# EAGLE schematic buscard (EAGLE 7.6.0)
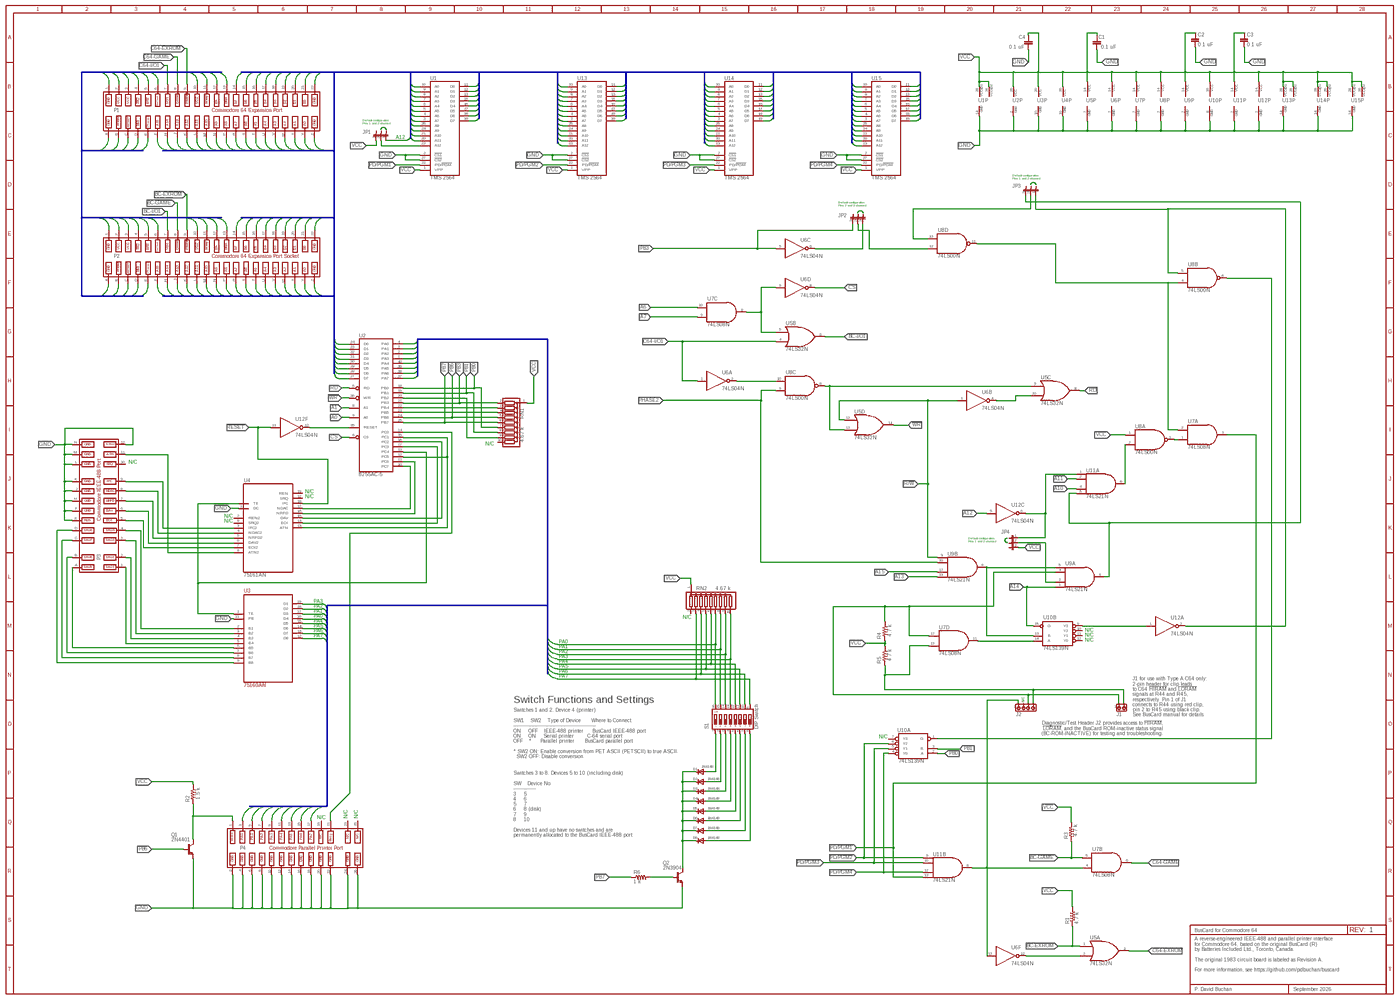
[diagram p0: schematic, sheet 1, overview]
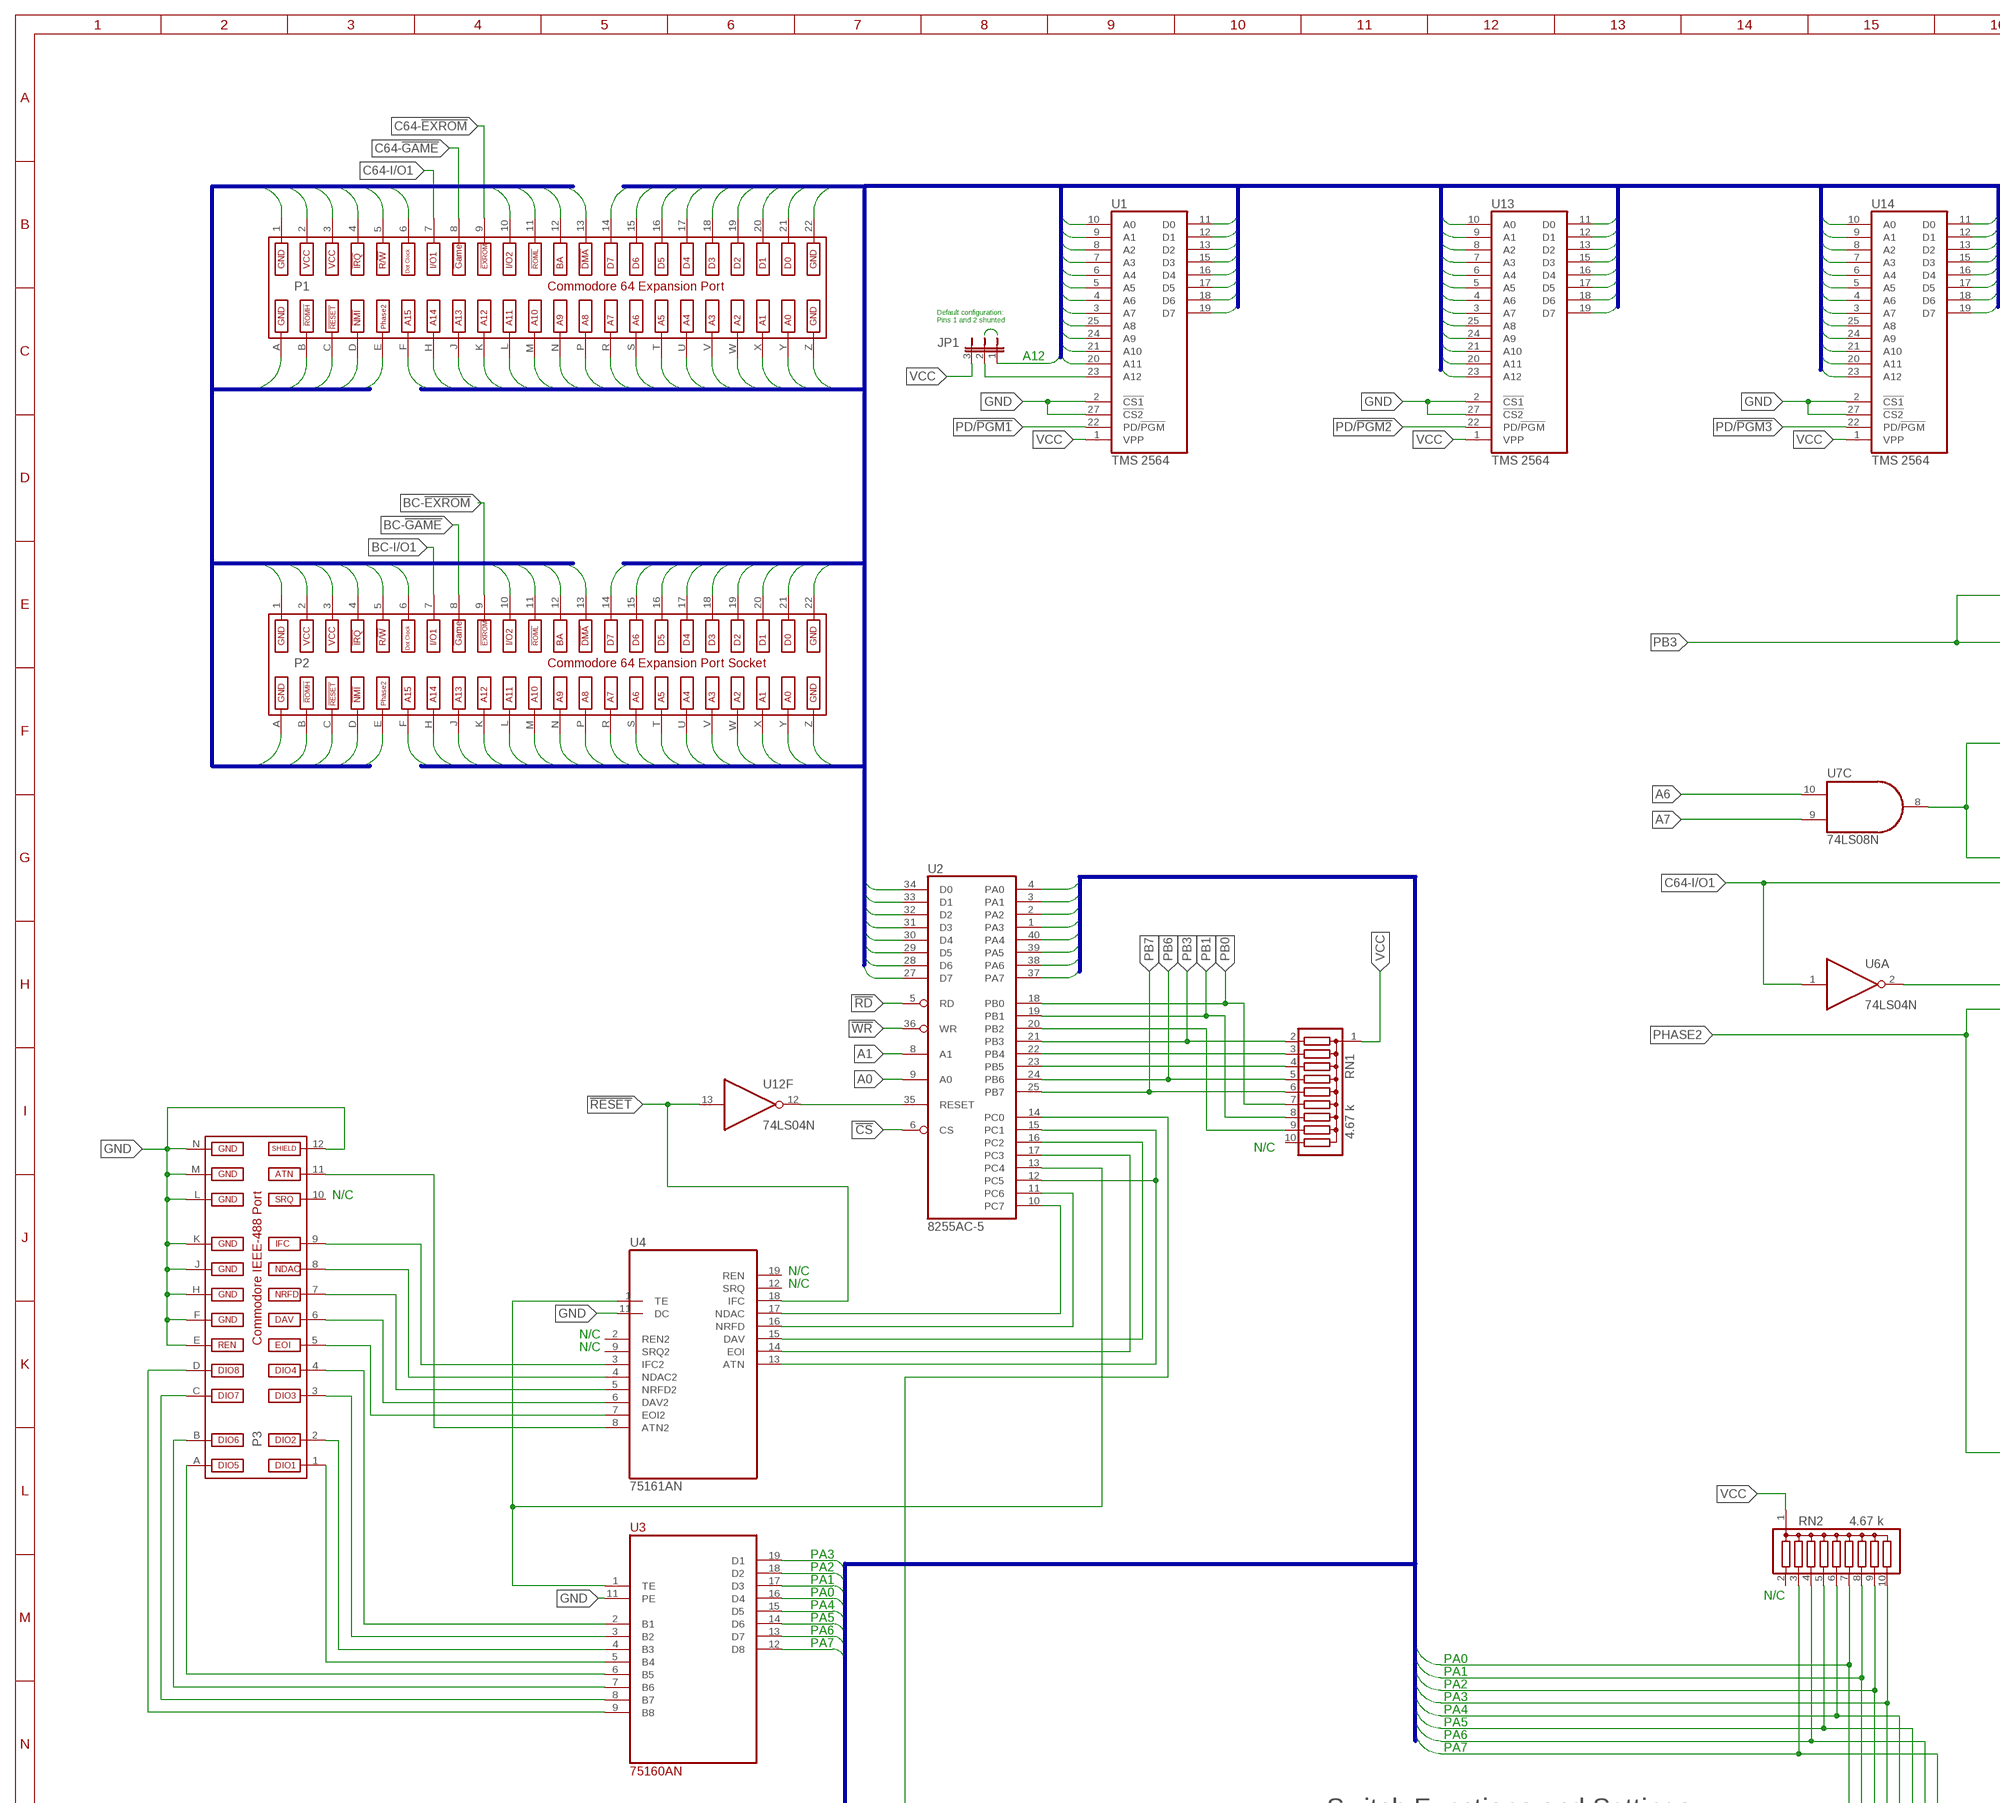
[diagram p1: schematic, sheet 1, part 1 of 4]
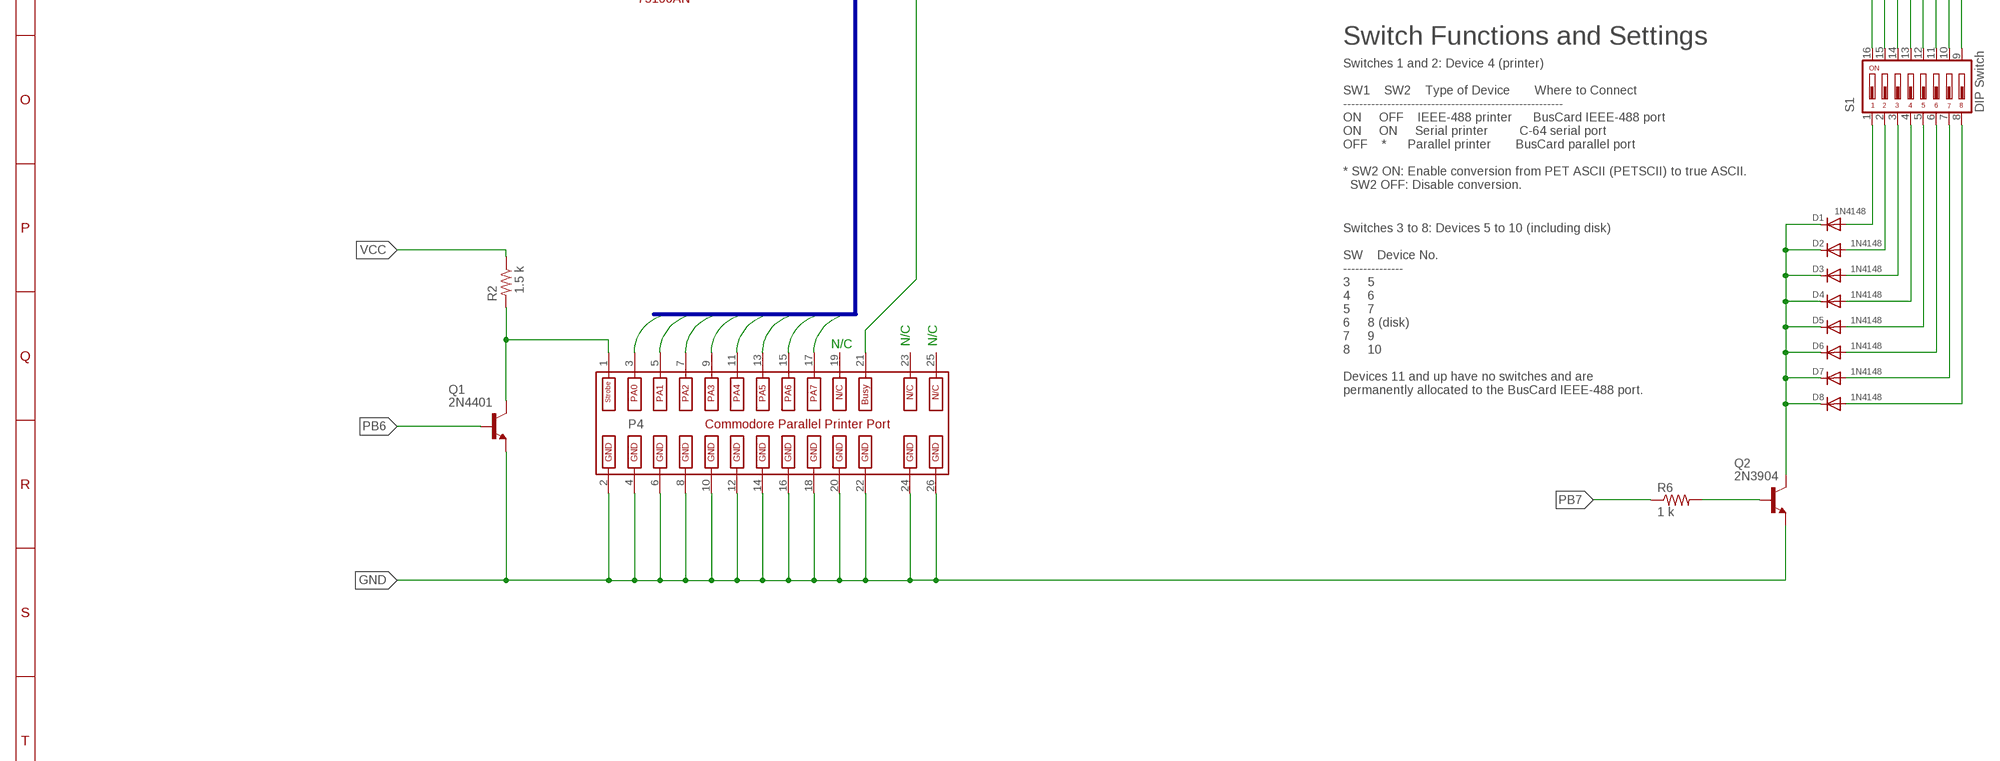
[diagram p2: schematic, sheet 1, part 2 of 4]
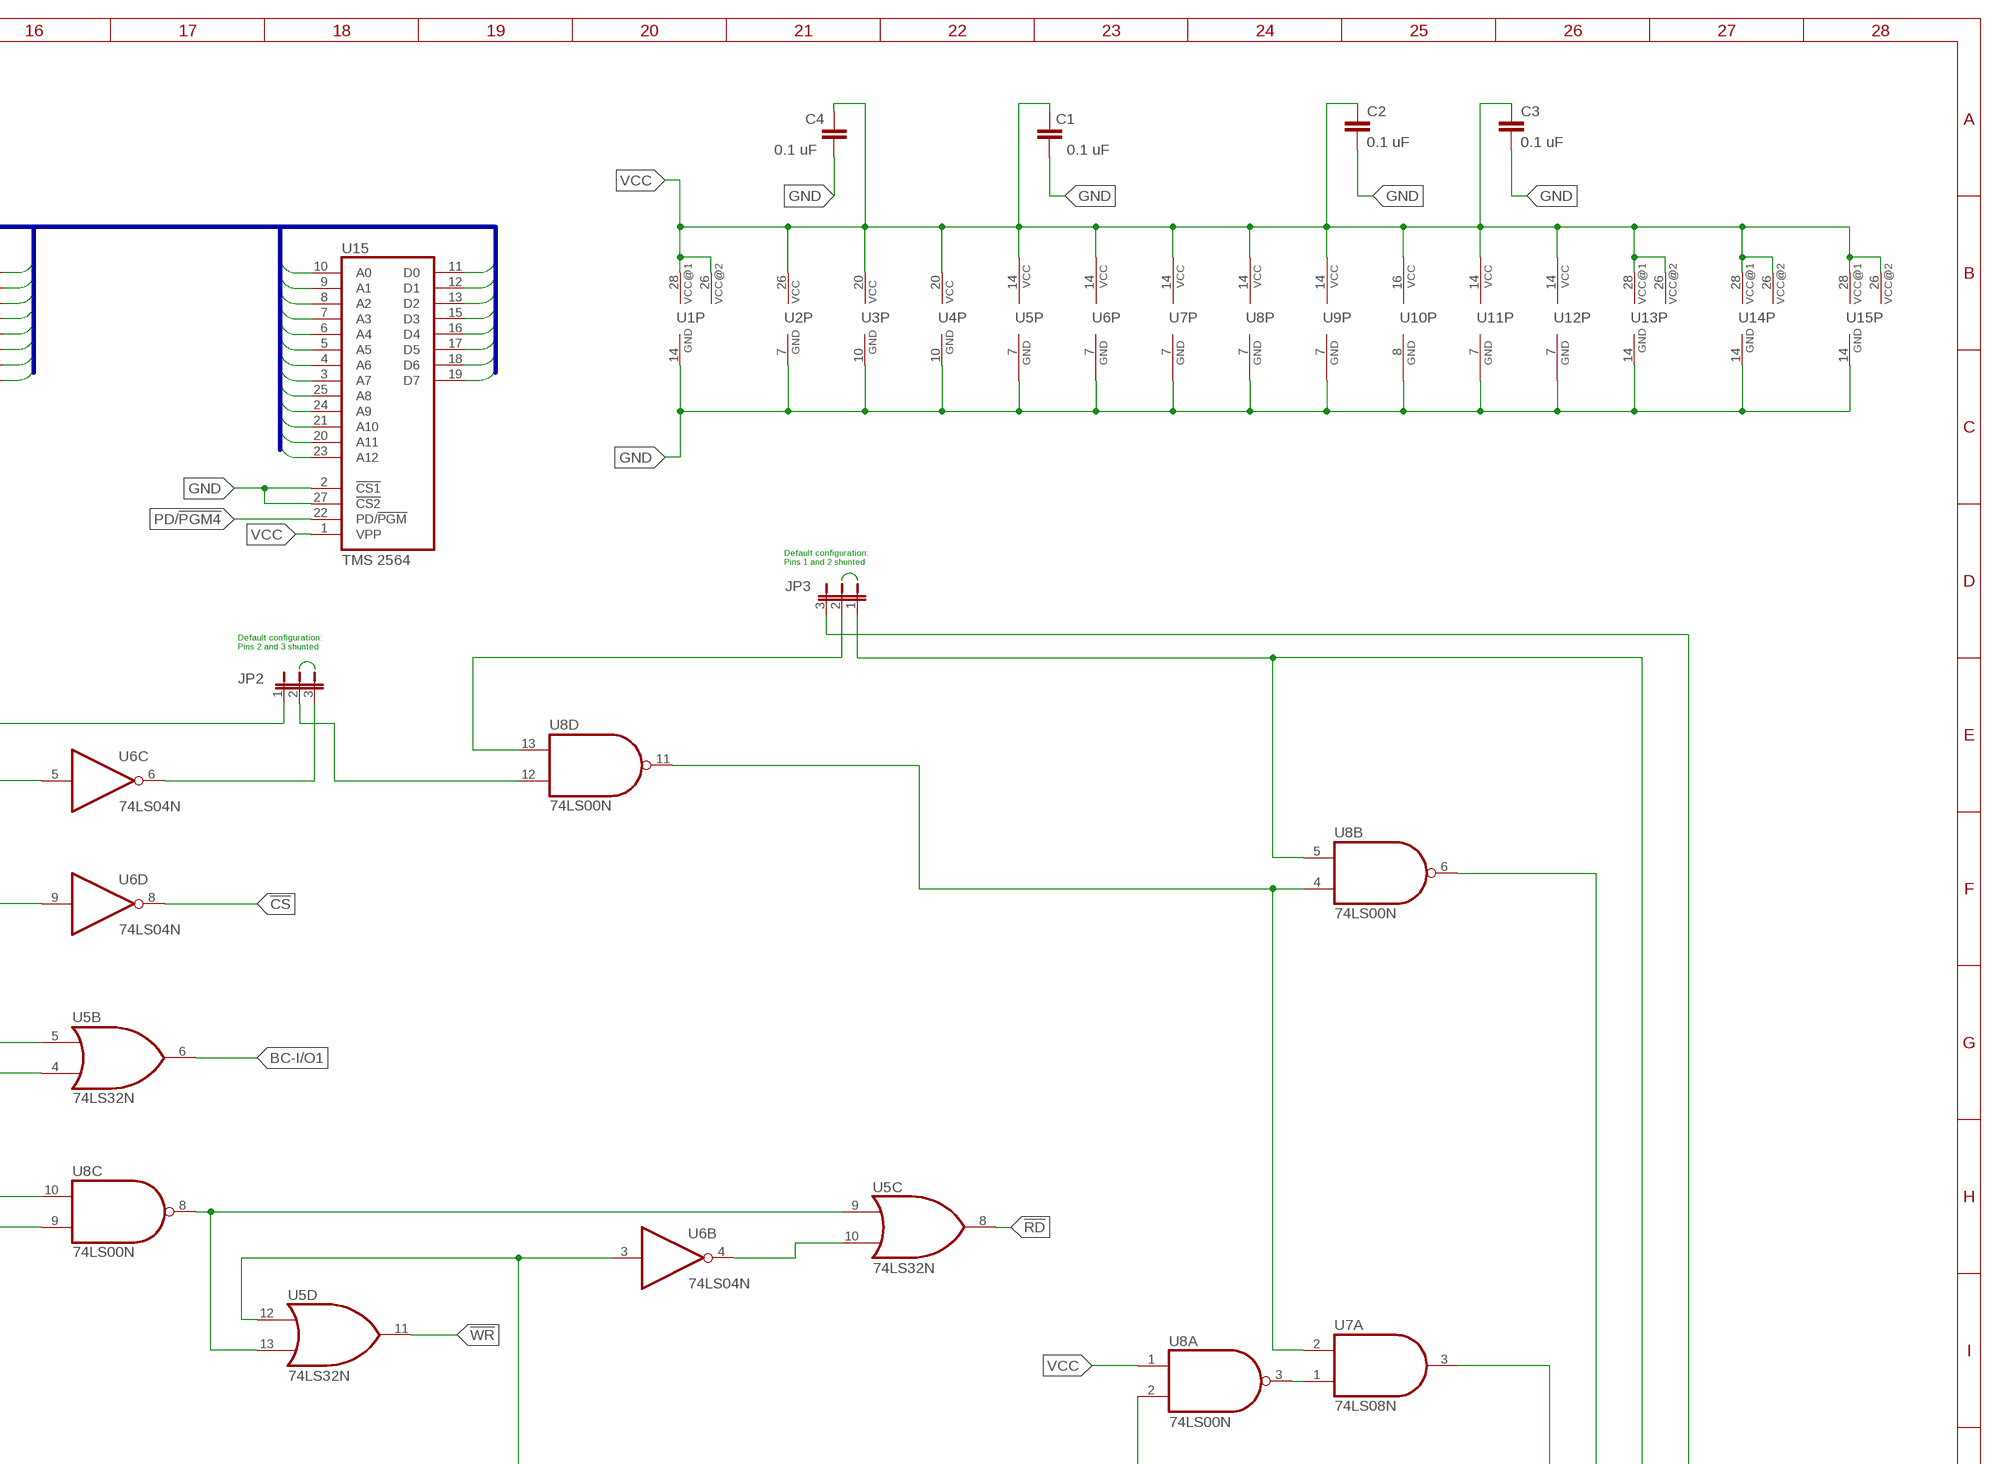
[diagram p3: schematic, sheet 1, part 3 of 4]
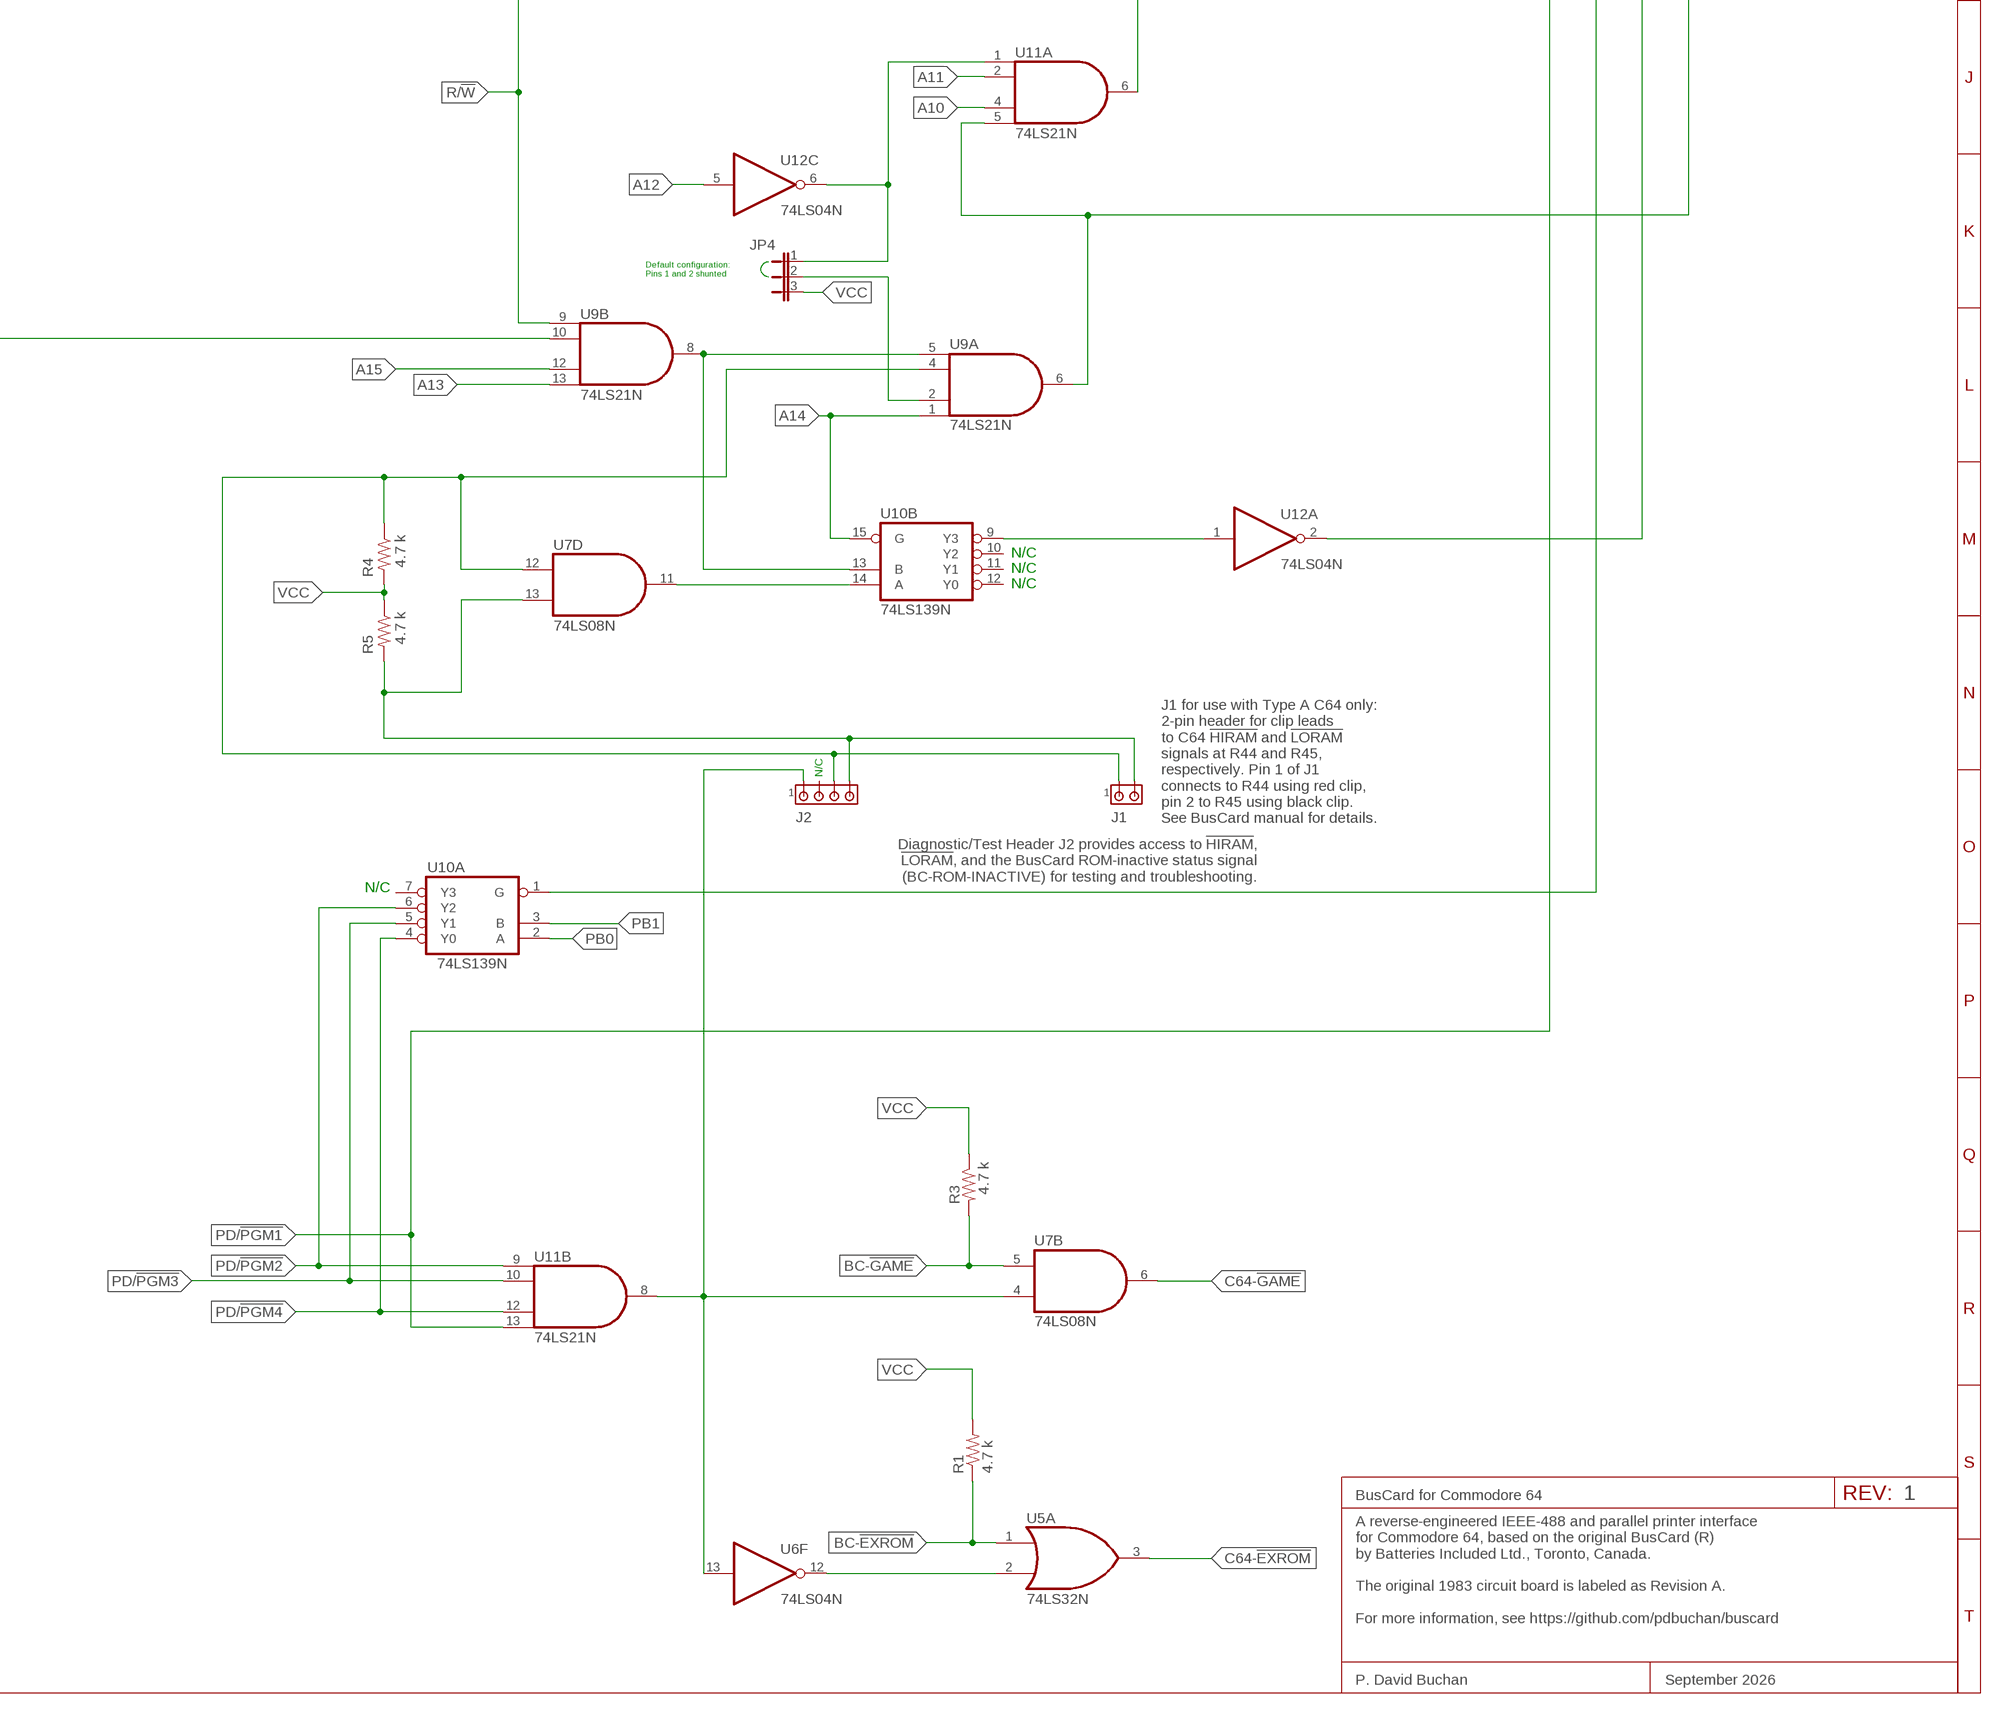
[diagram p4: schematic, sheet 1, part 4 of 4]

## Parts
C1  0.1 uF  C-EU075-032X103  [C075-032X103]
C2  0.1 uF  C-EU075-032X103  [C075-032X103]
C3  0.1 uF  C-EU075-032X103  [C075-032X103]
C4  0.1 uF  C-EU075-032X103  [C075-032X103]
D1  1N4148  DIODE-1N4148DO-1N4148  [DO-1N4148-0.2]
D2  1N4148  DIODE-1N4148DO-1N4148  [DO-1N4148-0.2]
D3  1N4148  DIODE-1N4148DO-1N4148  [DO-1N4148-0.2]
D4  1N4148  DIODE-1N4148DO-1N4148  [DO-1N4148-0.2]
D5  1N4148  DIODE-1N4148DO-1N4148  [DO-1N4148-0.2]
D6  1N4148  DIODE-1N4148DO-1N4148  [DO-1N4148-0.2]
D7  1N4148  DIODE-1N4148DO-1N4148  [DO-1N4148-0.2]
D8  1N4148  DIODE-1N4148DO-1N4148  [DO-1N4148-0.2]
J1  MTA02-100  [10X02MTA]
J2  MTA04-100  [10X04MTA]
JP1  JUMPER-HEADER-3-POSMTA-100  [JUMPER-HEADER-3-POS]
JP2  JUMPER-HEADER-3-POSMTA-100  [JUMPER-HEADER-3-POS]
JP3  JUMPER-HEADER-3-POSMTA-100  [JUMPER-HEADER-3-POS]
JP4  JUMPER-HEADER-3-POSMTA-100  [JUMPER-HEADER-3-POS]
P1  COMMODORE_64_EXPANSION_PORT_CARD_EDGE  [COMMODORE_64_EXPANSION_PORT_CARD_EDGE]
P2  FEMALE_44-PIN_CARD_EDGE_CONNECTOR  [FEMALE_44-PIN_CARD_EDGE_CONNECTOR]
P3  COMMODORE_IEEE-488_PORT_CARD_EDGE  [COMMODORE_IEEE-488_PORT_CARD_EDGE]
P4  Parallel Port  COMMODORE_PARALLEL_PORT_CARD_EDGE  [COMMODORE_PARALLEL_PORT_CARD_EDGE]
Q1  2N4401  2N4401-NPN-TO92-EBC  [TO92-EBC]
Q2  2N3904  [TO92]
R1  4.7 k  R-US_0207/10  [0207/10]
R2  1.5 k  R-US_0207/10  [0207/10]
R3  4.7 k  R-US_0207/10  [0207/10]
R4  4.7 k  R-US_0207/10  [0207/10]
R5  4.7 k  R-US_0207/10  [0207/10]
R6  1 k  R-US_0207/10  [0207/10]
RN1  4.67 k  G09R  [SIL10]
RN2  4.67 k  G09R  [SIL10]
S1  DIP Switch  DS08  [DS-08]
U1  TMS 2564  2564  [DIL28]
U2  8255AC-5  8255A  [DIL40]
U3  75160AN  [DIL20]
U4  75161AN  [DIL20]
U5  74LS32N  [DIL14]
U6  74LS04N  [DIL14]
U7  74LS08N  [DIL14]
U8  74LS00N  [DIL14]
U9  74LS21N  [DIL14]
U10  74LS139N  [DIL16]
U11  74LS21N  [DIL14]
U12  74LS04N  [DIL14]
U13  TMS 2564  2564  [DIL28]
U14  TMS 2564  2564  [DIL28]
U15  TMS 2564  2564  [DIL28]

## Nets
!CS: U2.6(CS) U6.8(D:O)
!DMA: P1.13(!DMA) P2.13(!DMA)
!IRQ: P1.4(!IRQ) P2.4(!IRQ)
!NMI: P1.D(!NMI) P2.D(!NMI)
!RD: U2.5(RD) U5.8(C:O)
!RESET: P1.C(!RESET) P2.C(!RESET) U4.18(IFC) U12.13(F:I)
!ROMH: P1.B(!ROMH) P2.B(!ROMH)
!ROML: P1.11(!ROML) P2.11(!ROML)
!WR: U2.36(WR) U5.11(D:O)
A0: P1.Y(A0) P2.Y(A0) U1.10(A0) U2.9(A0) U13.10(A0) U14.10(A0) U15.10(A0)
A1: P1.X(A1) P2.X(A1) U1.9(A1) U2.8(A1) U13.9(A1) U14.9(A1) U15.9(A1)
A2: P1.W(A2) P2.W(A2) U1.8(A2) U13.8(A2) U14.8(A2) U15.8(A2)
A3: P1.V(A3) P2.V(A3) U1.7(A3) U13.7(A3) U14.7(A3) U15.7(A3)
A4: P1.U(A4) P2.U(A4) U1.6(A4) U13.6(A4) U14.6(A4) U15.6(A4)
A5: P1.T(A5) P2.T(A5) U1.5(A5) U13.5(A5) U14.5(A5) U15.5(A5)
A6: P1.S(A6) P2.S(A6) U1.4(A6) U7.10(C:I1) U13.4(A6) U14.4(A6) U15.4(A6)
A7: P1.R(A7) P2.R(A7) U1.3(A7) U7.9(C:I0) U13.3(A7) U14.3(A7) U15.3(A7)
A8: P1.P(A8) P2.P(A8) U1.25(A8) U13.25(A8) U14.25(A8) U15.25(A8)
A9: P1.N(A9) P2.N(A9) U1.24(A9) U13.24(A9) U14.24(A9) U15.24(A9)
A10: P1.M(A10) P2.M(A10) U1.21(A10) U11.4(A:I2) U13.21(A10) U14.21(A10) U15.21(A10)
A11: P1.L(A11) P2.L(A11) U1.20(A11) U11.2(A:I1) U13.20(A11) U14.20(A11) U15.20(A11)
A12: JP1.1 P1.K(A12) P2.K(A12) U12.5(C:I) U13.23(A12) U14.23(A12) U15.23(A12)
A13: P1.J(A13) P2.J(A13) U9.13(B:I3)
A14: P1.H(A14) P2.H(A14) U9.1(A:I0) U10.15(B:G)
A15: P1.F(A15) P2.F(A15) U9.12(B:I2)
ATN: P3.11(ATN) U4.8(ATN2)
BA: P1.12(BA) P2.12(BA)
BC-!EXROM: P2.9(!EXROM) R1.1 U5.1(A:I0)
BC-!GAME: P2.8(!GAME) R3.2 U7.5(B:I1)
BC-I/O1: P2.7(I/O1) U5.6(B:O)
BC-ROM-INACTIVE: J2.1 U6.13(F:I) U7.4(B:I0) U11.8(B:O)
BUSY: P4.21(BUSY) U2.14(PC0)
C64-!EXROM: P1.9(!EXROM) U5.3(A:O)
C64-!GAME: P1.8(!GAME) U7.6(B:O)
C64-I/O1: P1.7(I/O1) U5.4(B:I0) U6.1(A:I)
CLIP1: J1.2 J2.4 R5.2 U7.13(D:I1)
CLIP2: J1.1 J2.3 R4.1 U7.12(D:I0) U9.4(A:I2)
D0: P1.21(D0) P2.21(D0) U1.11(D0) U2.34(D0) U13.11(D0) U14.11(D0) U15.11(D0)
D1: P1.20(D1) P2.20(D1) U1.12(D1) U2.33(D1) U13.12(D1) U14.12(D1) U15.12(D1)
D2: P1.19(D2) P2.19(D2) U1.13(D2) U2.32(D2) U13.13(D2) U14.13(D2) U15.13(D2)
D3: P1.18(D3) P2.18(D3) U1.15(D3) U2.31(D3) U13.15(D3) U14.15(D3) U15.15(D3)
D4: P1.17(D4) P2.17(D4) U1.16(D4) U2.30(D4) U13.16(D4) U14.16(D4) U15.16(D4)
D5: P1.16(D5) P2.16(D5) U1.17(D5) U2.29(D5) U13.17(D5) U14.17(D5) U15.17(D5)
D6: P1.15(D6) P2.15(D6) U1.18(D6) U2.28(D6) U13.18(D6) U14.18(D6) U15.18(D6)
D7: P1.14(D7) P2.14(D7) U1.19(D7) U2.27(D7) U13.19(D7) U14.19(D7) U15.19(D7)
DAV: P3.6(DAV) U4.6(DAV2)
DIO1: P3.1(DIO1) U3.5(B4)
DIO2: P3.2(DIO2) U3.4(B3)
DIO3: P3.3(DIO3) U3.3(B2)
DIO4: P3.4(DIO4) U3.2(B1)
DIO5: P3.A(DIO5) U3.6(B5)
DIO6: P3.B(DIO6) U3.7(B6)
DIO7: P3.C(DIO7) U3.8(B7)
DIO8: P3.D(DIO8) U3.9(B8)
DOT_CLOCK: P1.6(DOT_CLOCK) P2.6(DOT_CLOCK)
EOI: P3.5(EOI) U4.7(EOI2)
GND: C1.1 C2.2 C3.2 C4.2 P1.1(GND) P1.22(GND) P1.A(GND) P1.Z(GND) P2.1(GND) P2.22(GND) P2.A(GND) P2.Z(GND) P3.12(SHIELD) P3.E(REN) P3.F(GND) P3.H(GND) P3.J(GND) P3.K(GND) P3.L(GND) P3.M(GND) P3.N(GND) P4.2(GND) P4.4(GND) P4.6(GND) P4.8(GND) P4.10(GND) P4.12(GND) P4.14(GND) P4.16(GND) P4.18(GND) P4.20(GND) P4.22(GND) P4.24(GND) P4.26(GND) Q1.E Q2.3(E) U1.2(!CS1) U1.14(GND) U1.27(!CS2) U2.7(GND) U3.10(GND) U3.11(PE) U4.10(GND) U4.11(DC) U5.7(P:GND) U6.7(P:GND) U7.7(P:GND) U8.7(P:GND) U9.7(P:GND) U10.8(P:GND) U11.7(P:GND) U12.7(P:GND) U13.2(!CS1) U13.14(GND) U13.27(!CS2) U14.2(!CS1) U14.14(GND) U14.27(!CS2) U15.2(!CS1) U15.14(GND) U15.27(!CS2)
I/O2: P1.10(I/O2) P2.10(I/O2)
IFC: P3.9(IFC) U4.3(IFC2)
N$1: JP2.3 U6.6(C:O)
N$2: JP2.2 U8.12(D:I0)
N$3: JP3.2 U8.13(D:I1)
N$4: U8.6(B:O) U10.1(A:G)
N$5: U6.2(A:O) U8.10(C:I1)
N$6: U5.10(C:I1) U6.4(B:O)
N$7: U5.9(C:I0) U5.13(D:I1) U8.8(C:O)
N$8: U9.5(A:I3) U9.8(B:O) U10.13(B:B)
N$9: U8.2(A:I1) U11.6(A:O)
N$10: JP4.2 U9.2(A:I1)
N$11: JP4.1 U11.1(A:I0) U12.6(C:O)
N$13: JP3.3 U9.6(A:O) U11.5(A:I3)
N$14: U7.1(A:I0) U8.3(A:O)
N$15: U10.9(B:Y3) U12.1(A:I)
N$16: U7.11(D:O) U10.14(B:A)
N$17: D1.A S1.1
N$18: U5.2(A:I1) U6.12(F:O)
N$19: D2.A S1.2
N$20: D3.A S1.3
N$21: D4.A S1.4
N$22: D5.A S1.5
N$23: D6.A S1.6
N$24: D7.A S1.7
N$25: JP1.2 U1.23(A12)
N$26: D8.A S1.8
N$27: U2.10(PC7) U4.17(NDAC)
N$28: Q2.2(B) R6.2
N$29: D1.C D2.C D3.C D4.C D5.C D6.C D7.C D8.C Q2.1(C)
N$30: U2.11(PC6) U4.16(NRFD)
N$31: RN1.3 U2.22(PB4)
N$32: RN1.4 U2.23(PB5)
N$33: RN1.9 U2.20(PB2)
N$34: U2.16(PC2) U4.15(DAV)
N$35: U2.35(RESET) U12.12(F:O)
N$38: U7.2(A:I1) U8.4(B:I0) U8.11(D:O)
N$39: JP3.1 U8.5(B:I1) U12.2(A:O)
N$40: U5.5(B:I1) U6.9(D:I) U7.8(C:O)
N$41: U2.17(PC3) U4.14(EOI)
N$42: U2.12(PC5) U2.15(PC1) U4.13(ATN)
NDAC: P3.8(NDAC) U4.4(NDAC2)
NRFD: P3.7(NRFD) U4.5(NRFD2)
PA0: P4.3(PA0) RN2.7 S1.16 U2.4(PA0) U3.16(D4)
PA1: P4.5(PA1) RN2.8 S1.15 U2.3(PA1) U3.17(D3)
PA2: P4.7(PA2) RN2.9 S1.14 U2.2(PA2) U3.18(D2)
PA3: P4.9(PA3) RN2.10 S1.13 U2.1(PA3) U3.19(D1)
PA4: P4.11(PA4) RN2.6 S1.12 U2.40(PA4) U3.15(D5)
PA5: P4.13(PA5) RN2.5 S1.11 U2.39(PA5) U3.14(D6)
PA6: P4.15(PA6) RN2.4 S1.10 U2.38(PA6) U3.13(D7)
PA7: P4.17(PA7) RN2.3 S1.9 U2.37(PA7) U3.12(D8)
PB0: RN1.7 U2.18(PB0) U10.2(A:A)
PB1: RN1.8 U2.19(PB1) U10.3(A:B)
PB3: JP2.1 RN1.2 U2.21(PB3) U6.5(C:I)
PB6: Q1.B RN1.5 U2.24(PB6)
PB7: R6.1 RN1.6 U2.25(PB7)
PD/!PGM1: U1.22(PD/!PGM) U7.3(A:O) U11.13(B:I3)
PD/!PGM2: U10.6(A:Y2) U11.9(B:I0) U13.22(PD/!PGM)
PD/!PGM3: U10.5(A:Y1) U11.10(B:I1) U14.22(PD/!PGM)
PD/!PGM4: U10.4(A:Y0) U11.12(B:I2) U15.22(PD/!PGM)
PHASE2: P1.E(PHASE2) P2.E(PHASE2) U8.9(C:I0) U9.10(B:I1)
R/!W: P1.5(R/!W) P2.5(R/!W) U5.12(D:I0) U6.3(B:I) U9.9(B:I0)
STROBE: P4.1(STROBE) Q1.C R2.2
TE: U2.13(PC4) U3.1(TE) U4.1(TE)
VCC: C1.2 C2.1 C3.1 C4.1 JP1.3 JP4.3 P1.2(VCC) P1.3(VCC) P2.2(VCC) P2.3(VCC) R1.2 R2.1 R3.1 R4.2 R5.1 RN1.1 RN2.1 U1.1(VPP) U1.26(VCC) U1.28(VCC) U2.26(VCC) U3.20(VCC) U4.20(VCC) U5.14(P:VCC) U6.14(P:VCC) U7.14(P:VCC) U8.1(A:I0) U8.14(P:VCC) U9.14(P:VCC) U10.16(P:VCC) U11.14(P:VCC) U12.14(P:VCC) U13.1(VPP) U13.26(VCC) U13.28(VCC) U14.1(VPP) U14.26(VCC) U14.28(VCC) U15.1(VPP) U15.26(VCC) U15.28(VCC)
Unconnected: J2.2 P3.10(SRQ) P4.19(N/C) P4.23(N/C) P4.25(N/C) RN1.10 RN2.2 U4.2(REN2) U4.9(SRQ2) U4.12(SRQ) U4.19(REN) U6.10(E:O) U6.11(E:I) U10.7(A:Y3) U10.10(B:Y2) U10.11(B:Y1) U10.12(B:Y0) U12.3(B:I) U12.4(B:O) U12.8(D:O) U12.9(D:I) U12.10(E:O) U12.11(E:I)

## Buses
PA[0..7]
VCC,GND,!IRQ,R/!W,DOT_CLOCK,I/O2,!ROML,BA,!DMA,!ROMH,!RESET,!NMI,PHASE2
A[0..15],D[0..7],GND

## Notes on the sheet
- Default configuration:
  Pins 1 and 2 shunted
- A12
- Default configuration:
  Pins 1 and 2 shunted
- Default configuration:
  Pins 2 and 3 shunted
- N/C
- N/C
- N/C
- N/C
- N/C
- N/C
- Default configuration:
  Pins 1 and 2 shunted
- PA3
- PA2
- PA1
- PA0 | N/C
- PA4
- PA5
- PA6 | N/C
- PA7 | N/C
- N/C
- PA0
- PA1
- PA2
- PA3
- PA4
- PA5
- PA6
- PA7
- N/C
- Switch Functions and Settings
- J1 for use with Type A C64 only:
  2-pin header for clip leads
  to C64 !HIRAM! and !LORAM!
  signals at R44 and R45,
  respectively. Pin 1 of J1
  connects to R44 using red clip,
  pin 2 to R45 using black clip.
  See BusCard manual for details.
- Diagnostic/Test Header J2 provides access to !HIRAM!,
  !LORAM!, and the BusCard ROM-inactive status signal
  (BC-ROM-INACTIVE) for testing and troubleshooting.
- N/C
- Switches 1 and 2: Device 4 (printer)
  
  SW1    SW2    Type of Device       Where to Connect
  -------------------------------------------------------
  ON     OFF    IEEE-488 printer      BusCard IEEE-488 port
  ON     ON     Serial printer         C-64 serial port
  OFF    *      Parallel printer       BusCard parallel port
  
  * SW2 ON: Enable conversion from PET ASCII (PETSCII) to true ASCII.
    SW2 OFF: Disable conversion.
- N/C
- N/C | N/C
- Switches 3 to 8: Devices 5 to 10 (including disk)
  
  SW    Device No.
  ---------------
  3     5
  4     6
  5     7
  6     8 (disk)
  7     9
  8     10
  
  Devices 11 and up have no switches and are
  permanently allocated to the BusCard IEEE-488 port.
- BusCard for Commodore 64 | 1
- A reverse-engineered IEEE-488 and parallel printer interface
  for Commodore 64, based on the original BusCard (R)
  by Batteries Included Ltd., Toronto, Canada.
  
  The original 1983 circuit board is labeled as Revision A.
  
  For more information, see https://github.com/pdbuchan/buscard
- P. David Buchan | September 2026

## Library data of the parts
C1-C4 = rcl:C-EU: CAPACITOR, European symbol
D1-D8 = 1N4148:DIODE-1N4148: Diode SMADIODE - SMA Surface Mount Package 20V 1A Schottky Diode Digikey: 641-1014-6-ND DO-1N4148 - Through Hole Small Current Diode SOD-123 20V 1 A (.5mV Vf) Schottky Diode - Digikey: MBRX120TPMSCT-ND SOD-323 10V 570mA (.38mV Vf, 3ns) Schottky Diode - Digikey: ZLLS410CT-ND SOD-523 30V 30mA Schottky Diode (RB751S-40TE61) - Digikey: RB751S-40TE61CT-ND SOT23-R/W - SOT23 Package (R = Solder Paste/Reflow Ovens, W = Hand-Soldering) BAT54Film 40V 300mA - Digikey: 497-7162-1-ND
J1 = clip-header-MTA02-100:MTA02-100: AMP connector
J2 = diagnostic-header-MTA04-100:MTA04-100: AMP connector
JP1-JP4 = jumper-header-3:JUMPER-HEADER-3-POS: Wire-to-board connector header, 3-position, 1-row, straight, 0.1" (2.54 mm) contact spacing (pitch), MTA-100 series
P1 = commodore-card-edges:COMMODORE_64_EXPANSION_PORT_CARD_EDGE: Commodore 64 44-Contact (22 top + 22 bottom) Expansion Port Card-Edge. Contacts are 0.05" x 0.35" on a 0.1" pitch. Contacts are numbered 1 to 22 on top and A to Z on bottom (excludes G, I, O, and Q). Contacts 1 and A are on same end of card-edge. Card edge protrudes 0.55" from main circuit board.
P2 = female-44-pin-edge-connector:FEMALE_44-PIN_CARD_EDGE_CONNECTOR: Female Connector for Commodore 64 44-Contact (22 top + 22 bottom) Expansion Port Card-Edge. Contacts are on a 0.1" (2.54 mm) pitch. Row pitch is 0.2" (5.08 mm). Contacts are numbered 1 to 22 on top and A to Z on bottom (excludes G, I, O, and Q). Contacts 1 and A are on same end of card-edge. Accepts board thickness of 0.062" (1.57 mm).
P3 = commodore-card-edges:COMMODORE_IEEE-488_PORT_CARD_EDGE: Commodore 24-Contact (12 top + 12 bottom) IEEE-488 Port Card-Edge. Contacts are 0.09" x 0.35" on a 0.156" pitch. Contacts are numbered 1 to 12 on top and A to N on bottom (excludes G and I). Contacts 1 and A are on same end of card-edge. There is a 0.066" gap between contacts 2/B and 3/C and 9/K and10/L. Card edge protrudes 0.55" from main circuit board.
P4 = commodore-card-edges:COMMODORE_PARALLEL_PORT_CARD_EDGE: Commodore 26-Contact (13 top + 13 bottom) Parallel Port Card-Edge. Contacts are 0.05" x 0.35" on a 0.1" pitch. Numbering alternates between top and bottom, with contact 1 at bottom. Contacts 1 and 2 are on same end of card-edge. There is a 0.05" gap between contacts 21/22 and 23/24. Card edge protrudes 0.55" from main circuit board.
Q1 = transistor-neu-to92:*-NPN-: NPN Transistror
Q2 = transistor-neu-to92:2N3904: NPN TRANSISTOR
R1-R4 R6 = adafruit:R-US_: RESISTOR, American symbol
R5 = resistor:R-US_: RESISTOR, American symbol
RN1 RN2 = resistor-sil:G09R: SIL RESISTOR; OC_FARNELL: unknown; OC_NEWARK: unknown
S1 = dip-switch-DS08:DS08: DIL/CODE SWITCH; MPN: DS08; OC_FARNELL: unknown; OC_NEWARK: 73J0071
U1 U13-U15 = 2564:2564: MEMORY
U2 = micro-intel:8255A: MICROCOMPUTER/PERIPHERAL DEVICE; OC_FARNELL: unknown; OC_NEWARK: unknown
U3 = 75160AN:75160: 75xxx DEVICE
U4 = 75161AN:75161: 75xxx DEVICE
U5 = 74LS32N:74*32: Quad 2-input OR gate
U6 = 74LS04N:74*04: Hex INVERTER
U7 = 74LS08N:74*08: Quad 2-input AND gate
U8 = 74LS00N:74*00: Quad 2-input NAND gate
U9 U11 = 74LS21N:74*21: Dual 4-input AND gate
U10 = 74xx-us:74*139: Dual 2-line to 4-line DECODER/DEMULTIPLEXER
U12 = 74xx-us:74*04: Hex INVERTER

## Net classes
0 default: width 0.254 mm, drill 0.508 mm, clearance 0.254 mm